# EAGLE design MainBoard (EAGLE 9.3.0)
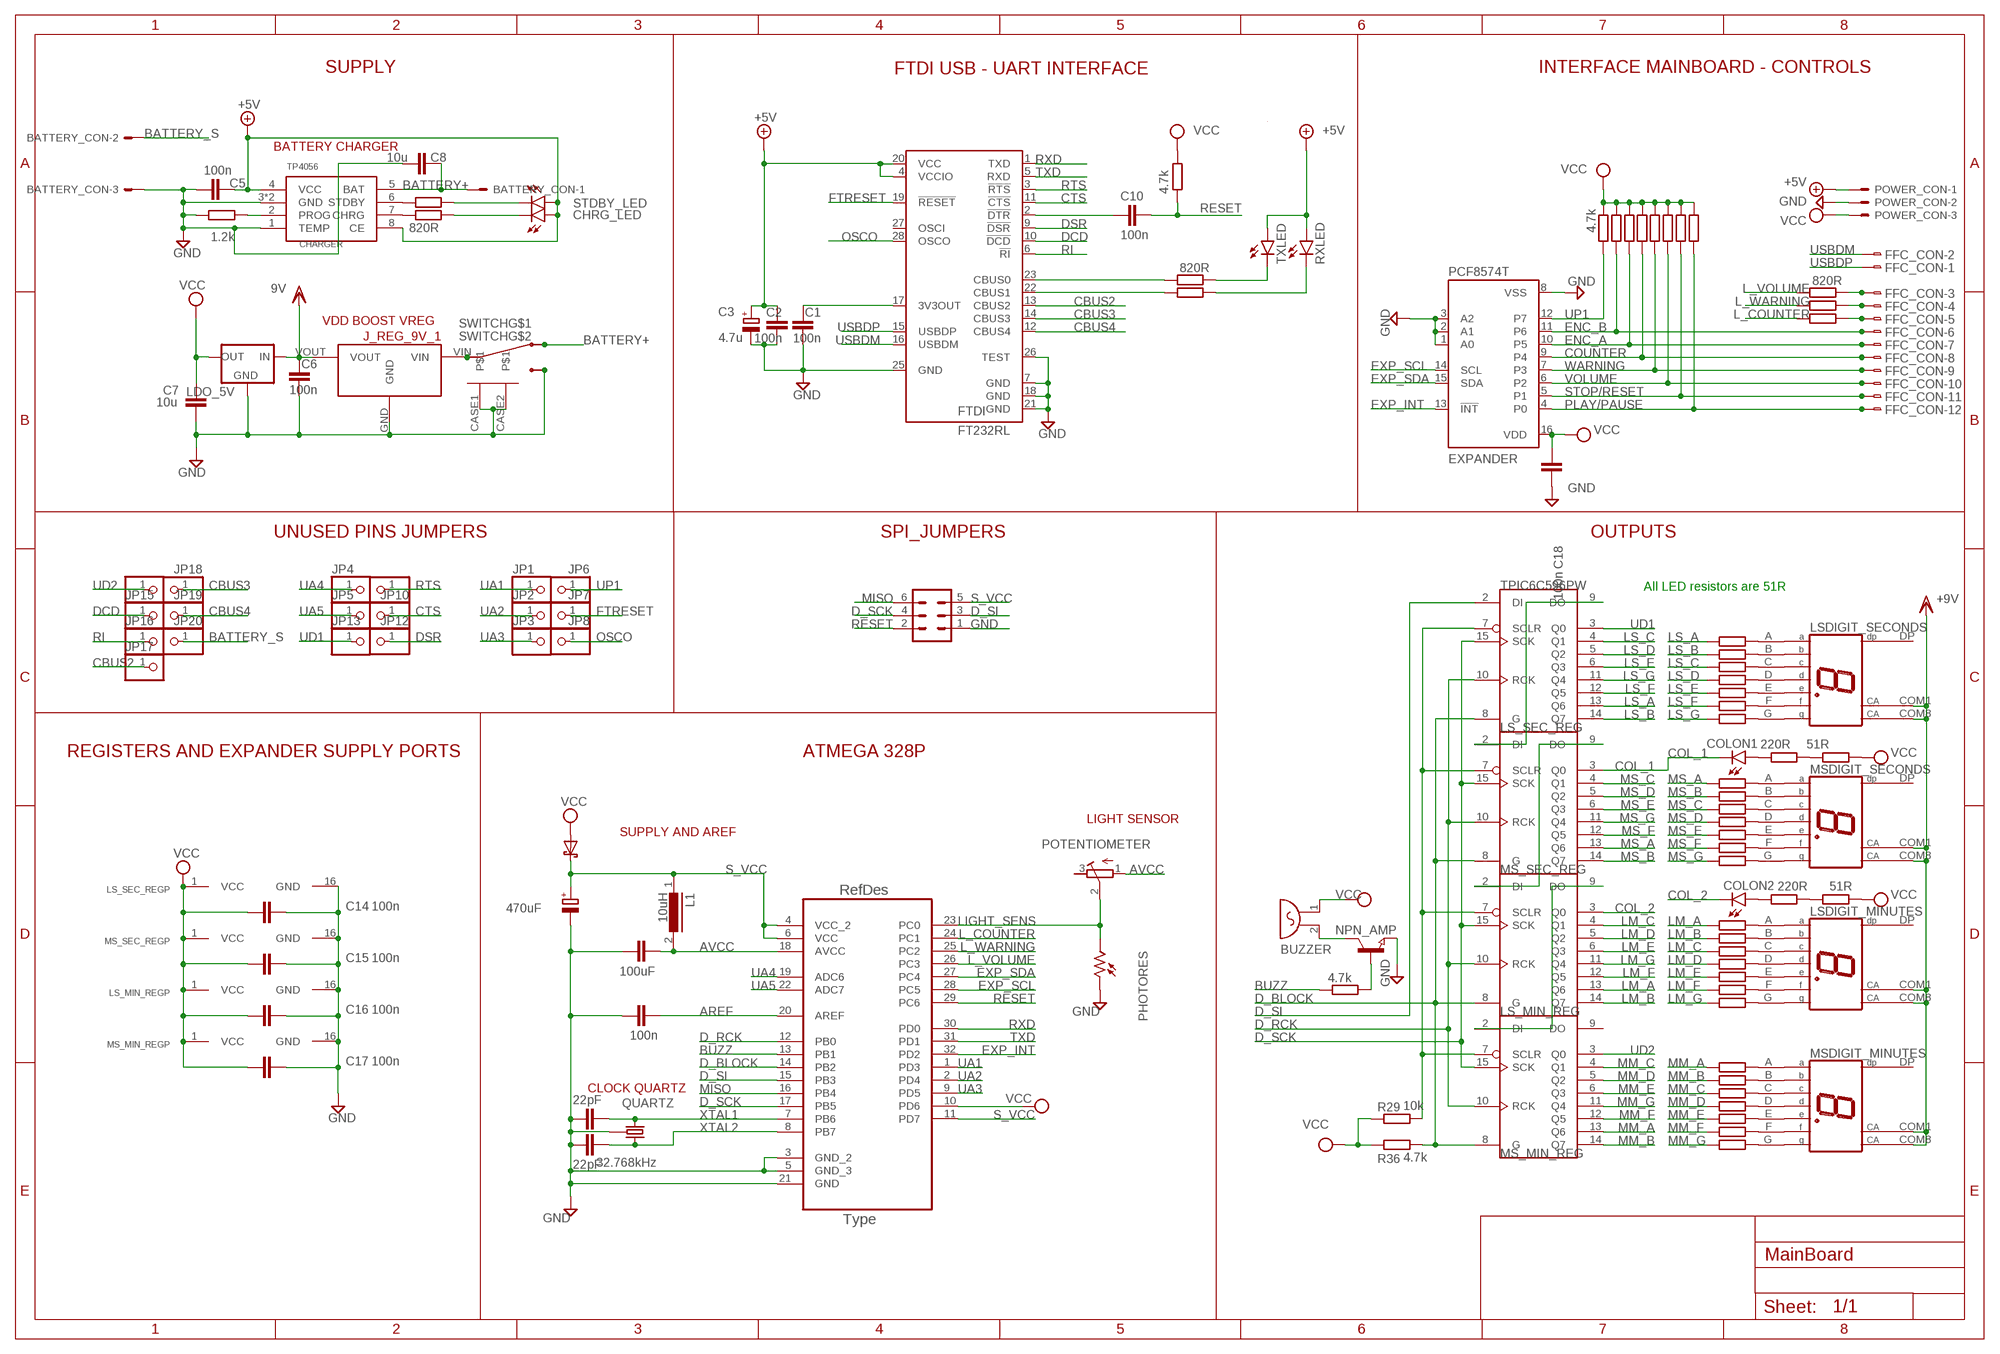
[diagram p0: schematic, sheet 1]

## Parts
ATMEGA328P  ATMEGA328P-AU  [QFP80P900X900X120-32N]
BATTERY_CON  JST-XH-03-PIN-LONG-PAD  [JST-XH-03-PACKAGE-LONG-PAD]
BUZZER  F/HGP  [F/HGP]
C1  100n  C-EUC0603  [C0603]
C2  100n  C-EUC0603  [C0603]
C3  4.7u  CPOL-EUSMCB  [SMC_B]
C4  100n  C-EUC0603  [C0603]
C5  100n  C-EUC0603  [C0603]
C6  100n  C-EUC0603  [C0603]
C7  10u  C-EUC1206  [C1206]
C8  10u  C-EUC1206  [C1206]
C10  100n  C-EUC0603  [C0603]
C14  100n  C-EUC0603  [C0603]
C15  100n  C-EUC0603  [C0603]
C16  100n  C-EUC0603  [C0603]
C17  100n  C-EUC0603  [C0603]
C18  100n  C-EUC0603  [C0603]
C29  22pF  C-EUC0603  [C0603]
C30  22pF  C-EUC0603  [C0603]
C31  470uF  CPOL-EU153CLV-0810  [153CLV-0810]
C32  100uF  C-EUC1210  [C1210]
CHARGER  TP4056  [SOP-8]
CHRG_LED  LEDCHIPLED_0603  [CHIPLED_0603]
COLON1  LED5MM  [LED5MM]
COLON2  LED5MM  [LED5MM]
EXPANDER  PCF8574T  [SO16W]
FFC_CON  FH12-12S-0.5S_THINNER  [FH12-12S-0.5SH_THINER]
FTDI  FT232RL  [SSOP28]
J_REG_9V_1  9V_VOLTAGE_REGULATOR  [9V_VOLTAGE_REGULATOR]
JP1  PINHD-1X1  [1X01]
JP2  PINHD-1X1  [1X01]
JP3  PINHD-1X1  [1X01]
JP4  PINHD-1X1  [1X01]
JP5  PINHD-1X1  [1X01]
JP6  PINHD-1X1  [1X01]
JP7  PINHD-1X1  [1X01]
JP8  PINHD-1X1  [1X01]
JP9  PINHD-1X1  [1X01]
JP10  PINHD-1X1  [1X01]
JP12  PINHD-1X1  [1X01]
JP13  PINHD-1X1  [1X01]
JP14  PINHD-1X1  [1X01]
JP15  PINHD-1X1  [1X01]
JP16  PINHD-1X1  [1X01]
JP17  PINHD-1X1  [1X01]
JP18  PINHD-1X1  [1X01]
JP19  PINHD-1X1  [1X01]
JP20  PINHD-1X1  [1X01]
L1  10uH  DR73  [DR73]
LDO_5V  LM1117  [SOT223]
LS_MIN_REG  TPIC6C596PW  [SO16]
LS_SEC_REG  TPIC6C596PW  [SO16]
LSDIGIT_MINUTES  LED-7-SEGM-56MM  [MYTHT]
LSDIGIT_SECONDS  LED-7-SEGM-56MM  [MYTHT]
MS_MIN_REG  TPIC6C596PW  [SO16]
MS_SEC_REG  TPIC6C596PW  [SO16]
MSDIGIT_MINUTES  LED-7-SEGM-56MM  [MYTHT]
MSDIGIT_SECONDS  LED-7-SEGM-56MM  [MYTHT]
NPN_AMP  NPN-TRANSISTOR_SOT23  [SOT23]
PHOTORES  VT90N1  [VT900]
POTENTIOMETER  R-TRIMM3296Y  [RTRIM3296Y]
POWER_CON  JST-XH-03-PIN-LONG-PAD  [JST-XH-03-PACKAGE-LONG-PAD]
QUARTZ  32.768kHz  CRYSTAL-32.768KHZ_GNDSMD-2X6  [CRYSTAL-SMD-2X6-CYL]
R1  50  R-EU_R0603  [R0603]
R2  50  R-EU_R0603  [R0603]
R3  50  R-EU_R0603  [R0603]
R4  50  R-EU_R0603  [R0603]
R5  50  R-EU_R0603  [R0603]
R6  50  R-EU_R0603  [R0603]
R7  50  R-EU_R0603  [R0603]
R8  50  R-EU_R0603  [R0603]
R9  50  R-EU_R0603  [R0603]
R10  50  R-EU_R0603  [R0603]
R11  50  R-EU_R0603  [R0603]
R12  50  R-EU_R0603  [R0603]
R13  50  R-EU_R0603  [R0603]
R14  50  R-EU_R0603  [R0603]
R15  50  R-EU_R0603  [R0603]
R16  50  R-EU_R0603  [R0603]
R17  50  R-EU_R0603  [R0603]
R18  50  R-EU_R0603  [R0603]
R19  50  R-EU_R0603  [R0603]
R20  50  R-EU_R0603  [R0603]
R21  50  R-EU_R0603  [R0603]
R22  50  R-EU_R0603  [R0603]
R23  50  R-EU_R0603  [R0603]
R24  50  R-EU_R0603  [R0603]
R25  50  R-EU_R0603  [R0603]
R26  50  R-EU_R0603  [R0603]
R27  50  R-EU_R0603  [R0603]
R28  50  R-EU_R0603  [R0603]
R29  10k  R-EU_R0603  [R0603]
R30  4.7k  R-EU_R0603  [R0603]
R31  4.7k  R-EU_R0603  [R0603]
R32  51R  R-EU_R0603  [R0603]
R33  4.7k  R-EU_R0603  [R0603]
R34  220R  R-EU_R0603  [R0603]
R35  51R  R-EU_R0603  [R0603]
R36  4.7k  R-EU_R0603  [R0603]
R39  820R  R-EU_R0603  [R0603]
R40  820R  R-EU_R0603  [R0603]
R42  4.7k  R-EU_R0603  [R0603]
R43  4.7k  R-EU_R0603  [R0603]
R44  4.7k  R-EU_R0603  [R0603]
R45  4.7k  R-EU_R0603  [R0603]
R46  4.7k  R-EU_R0603  [R0603]
R47  820R  R-EU_R0603  [R0603]
R48  1.2k  R-EU_R0603  [R0603]
R50  220R  R-EU_R0603  [R0603]
R52  820R  R-EU_R0603  [R0603]
R56  4.7k  R-EU_R0603  [R0603]
R61  4.7k  R-EU_R0603  [R0603]
R64  820R  R-EU_R0603  [R0603]
R65  820R  R-EU_R0603  [R0603]
R66  820R  R-EU_R0603  [R0603]
RXLED  LEDCHIPLED_0603  [CHIPLED_0603]
SHOTTKY  S2A  [DO214AA]
SPI_JUMPERS  MA03-2  [MA03-2]
STDBY_LED  LEDCHIPLED_0603  [CHIPLED_0603]
SWITCH  X2  [MINI]
TXLED  LEDCHIPLED_0603  [CHIPLED_0603]

## Nets
+5V: C2.2 C3.+ C5.1 CHARGER.4(VCC) CHARGER.8(CE) CHRG_LED.A FTDI.4(VCCIO) FTDI.20(VCC) POWER_CON.1 RXLED.A STDBY_LED.A TXLED.A
AREF: ATMEGA328P.20(AREF) C4.1
AVCC: ATMEGA328P.18(AVCC) C32.1 L1.2 POTENTIOMETER.1(A)
BATTERY+: BATTERY_CON.1 C8.2 CHARGER.5(BAT) SWITCH.1 SWITCH.4
BATTERY_S: BATTERY_CON.2 JP20.1
BUZZ: ATMEGA328P.13(PB1) R30.2
CBUS2: FTDI.13(CBUS2) JP17.1
CBUS3: FTDI.14(CBUS3) JP18.1
CBUS4: FTDI.12(CBUS4) JP19.1
COL_1: COLON1.K(C) MS_SEC_REG.3(Q0)
COL_2: COLON2.K(C) LS_MIN_REG.3(Q0)
COUNTER: EXPANDER.9(P4) FFC_CON.8 R42.2
CTS: FTDI.11(!CTS) JP10.1
D_BLOCK: ATMEGA328P.14(PB2) LS_MIN_REG.8(G) LS_SEC_REG.8(G) MS_MIN_REG.8(G) MS_SEC_REG.8(G) R36.1
D_RCK: ATMEGA328P.12(PB0) LS_MIN_REG.10(RCK) LS_SEC_REG.10(RCK) MS_MIN_REG.10(RCK) MS_SEC_REG.10(RCK)
D_SCK: ATMEGA328P.17(PB5) LS_MIN_REG.15(SCK) LS_SEC_REG.15(SCK) MS_MIN_REG.15(SCK) MS_SEC_REG.15(SCK) SPI_JUMPERS.4
D_SI: ATMEGA328P.15(PB3) LS_SEC_REG.2(DI) SPI_JUMPERS.3
DCD: FTDI.10(!DCD) JP15.1
DSR: FTDI.9(!DSR) JP12.1
DTR: C10.2 FTDI.2(!DTR)
ENC_A: EXPANDER.10(P5) FFC_CON.7 R33.2
ENC_B: EXPANDER.11(P6) FFC_CON.6 R31.2
EXP_INT: ATMEGA328P.32(PD2) EXPANDER.13(!INT)
EXP_SCL: ATMEGA328P.28(PC5) EXPANDER.14(SCL)
EXP_SDA: ATMEGA328P.27(PC4) EXPANDER.15(SDA)
FTRESET: FTDI.19(!RESET) JP7.1
GND: ATMEGA328P.3(GND_2) ATMEGA328P.5(GND_3) ATMEGA328P.21(GND) BATTERY_CON.3 C1.1 C2.1 C3.- C4.2 C5.2 C6.1 C7.2 C8.1 C14.1 C15.1 C16.1 C17.1 C18.1 C29.1 C30.1 C31.- C32.2 CHARGER.1(TEMP) CHARGER.3(GND) CHARGER.ETP(GND) EXPANDER.1(A0) EXPANDER.2(A1) EXPANDER.3(A2) EXPANDER.8(VSS) FTDI.7(GND) FTDI.18(GND) FTDI.21(GND) FTDI.25(GND) FTDI.26(TEST) J_REG_9V_1.GND LDO_5V.1(GND) LS_MIN_REG.16(GND) LS_SEC_REG.16(GND) MS_MIN_REG.16(GND) MS_SEC_REG.16(GND) NPN_AMP.2(E) PHOTORES.1 POWER_CON.2 QUARTZ.SHEILD(GND) R48.2 SPI_JUMPERS.1 SWITCH.3 SWITCH.6 SWITCH.CASE1 SWITCH.CASE2
L_COUNTER: ATMEGA328P.24(PC1) R52.2
L_VOLUME: ATMEGA328P.26(PC3) R64.2
L_WARNING: ATMEGA328P.25(PC2) R47.2
LIGHT_SENS: ATMEGA328P.23(PC0) PHOTORES.2 POTENTIOMETER.2(S)
LM_A: LS_MIN_REG.13(Q6) R7.2
LM_B: LS_MIN_REG.14(Q7) R6.2
LM_C: LS_MIN_REG.4(Q1) R5.2
LM_D: LS_MIN_REG.5(Q2) R4.2
LM_E: LS_MIN_REG.6(Q3) R3.2
LM_F: LS_MIN_REG.12(Q5) R2.2
LM_G: LS_MIN_REG.11(Q4) R1.2
LS_A: LS_SEC_REG.13(Q6) R21.2
LS_B: LS_SEC_REG.14(Q7) R20.2
LS_C: LS_SEC_REG.4(Q1) R19.2
LS_D: LS_SEC_REG.5(Q2) R18.2
LS_E: LS_SEC_REG.6(Q3) R17.2
LS_F: LS_SEC_REG.12(Q5) R16.2
LS_G: LS_SEC_REG.11(Q4) R15.2
MISO: ATMEGA328P.16(PB4) SPI_JUMPERS.6
MM_A: MS_MIN_REG.13(Q6) R27.2
MM_B: MS_MIN_REG.14(Q7) R26.2
MM_C: MS_MIN_REG.4(Q1) R25.2
MM_D: MS_MIN_REG.5(Q2) R24.2
MM_E: MS_MIN_REG.6(Q3) R23.2
MM_F: MS_MIN_REG.12(Q5) R22.2
MM_G: MS_MIN_REG.11(Q4) R28.2
MS_A: MS_SEC_REG.13(Q6) R14.2
MS_B: MS_SEC_REG.14(Q7) R13.2
MS_C: MS_SEC_REG.4(Q1) R12.2
MS_D: MS_SEC_REG.5(Q2) R11.2
MS_E: MS_SEC_REG.6(Q3) R10.2
MS_F: MS_SEC_REG.12(Q5) R9.2
MS_G: MS_SEC_REG.11(Q4) R8.2
N$1: R32.2 R50.1
N$3: MSDIGIT_MINUTES.F R22.1
N$13: LSDIGIT_MINUTES.G R1.1
N$14: MSDIGIT_MINUTES.E R23.1
N$15: LSDIGIT_MINUTES.F R2.1
N$16: LSDIGIT_MINUTES.E R3.1
N$17: LSDIGIT_MINUTES.D R4.1
N$18: LSDIGIT_MINUTES.C R5.1
N$19: LSDIGIT_MINUTES.B R6.1
N$20: FFC_CON.3 R64.1
N$21: MSDIGIT_MINUTES.D R24.1
N$22: FFC_CON.4 R47.1
N$23: MSDIGIT_MINUTES.C R25.1
N$24: LS_MIN_REG.7(SCLR) LS_SEC_REG.7(SCLR) MS_MIN_REG.7(SCLR) MS_SEC_REG.7(SCLR) R29.1
N$25: LSDIGIT_MINUTES.A R7.1
N$27: C1.2 FTDI.17(3V3OUT)
N$29: COLON2.A R34.2
N$30: FFC_CON.5 R52.1
N$31: MSDIGIT_MINUTES.B R26.1
N$32: MSDIGIT_MINUTES.A R27.1
N$33: MSDIGIT_SECONDS.G R8.1
N$34: MSDIGIT_SECONDS.F R9.1
N$35: MSDIGIT_SECONDS.E R10.1
N$36: FTDI.23(CBUS0) R66.2
N$37: MSDIGIT_SECONDS.D R11.1
N$38: MSDIGIT_SECONDS.C R12.1
N$39: MSDIGIT_SECONDS.B R13.1
N$40: MSDIGIT_SECONDS.A R14.1
N$41: LSDIGIT_SECONDS.G R15.1
N$42: LSDIGIT_SECONDS.F R16.1
N$43: FTDI.22(CBUS1) R65.2
N$44: LSDIGIT_SECONDS.E R17.1
N$45: LSDIGIT_SECONDS.D R18.1
N$46: LSDIGIT_SECONDS.C R19.1
N$47: LSDIGIT_SECONDS.B R20.1
N$48: LSDIGIT_SECONDS.A R21.1
N$49: R34.1 R35.2
N$52: CHARGER.7(CHRG) R39.2
N$53: CHARGER.6(STDBY) R40.2
N$54: CHRG_LED.C R39.1
N$55: R40.1 STDBY_LED.C
N$56: COLON1.A R50.2
N$57: MSDIGIT_MINUTES.G R28.1
N$64: R66.1 TXLED.C
N$65: NPN_AMP.1(B) R30.1
N$66: BUZZER.2 NPN_AMP.3(C)
N$74: R65.1 RXLED.C
N$78: LS_MIN_REG.2(DI) MS_SEC_REG.9(DO)
N$79: LS_MIN_REG.9(DO) MS_MIN_REG.2(DI)
N$80: LS_SEC_REG.9(DO) MS_SEC_REG.2(DI)
N$81: J_REG_9V_1.VIN SWITCH.2 SWITCH.5
N$82: CHARGER.2(PROG) R48.1
OSCO: FTDI.28(OSCO) JP8.1
PLAY/PAUSE: EXPANDER.4(P0) FFC_CON.12 R46.2
RESET: ATMEGA328P.29(PC6) C10.1 R56.1 SPI_JUMPERS.2
RI: FTDI.6(!RI) JP16.1
RTS: FTDI.3(!RTS) JP9.1
RXD: ATMEGA328P.30(PD0) FTDI.1(TXD)
S_VCC: ATMEGA328P.4(VCC_2) ATMEGA328P.6(VCC) ATMEGA328P.11(PD7) C31.+ L1.1 SHOTTKY.C SPI_JUMPERS.5
STOP/RESET: EXPANDER.5(P1) FFC_CON.11 R45.2
TXD: ATMEGA328P.31(PD1) FTDI.5(RXD)
UA1: ATMEGA328P.1(PD3) JP1.1
UA2: ATMEGA328P.2(PD4) JP2.1
UA3: ATMEGA328P.9(PD5) JP3.1
UA4: ATMEGA328P.19(ADC6) JP4.1
UA5: ATMEGA328P.22(ADC7) JP5.1
UD1: JP13.1 LS_SEC_REG.3(Q0)
UD2: JP14.1 MS_MIN_REG.3(Q0)
UP1: EXPANDER.12(P7) JP6.1 R61.2
USBDM: FFC_CON.2 FTDI.16(USBDM)
USBDP: FFC_CON.1 FTDI.15(USBDP)
VCC: ATMEGA328P.10(PD6) BUZZER.1 C7.1 C14.2 C15.2 C16.2 C17.2 C18.2 EXPANDER.16(VDD) LDO_5V.2(OUT) LDO_5V.4(OUT) LS_MIN_REG.1(VCC) LS_SEC_REG.1(VCC) MS_MIN_REG.1(VCC) MS_SEC_REG.1(VCC) POWER_CON.3 R29.2 R31.1 R32.1 R33.1 R35.1 R36.2 R42.1 R43.1 R44.1 R45.1 R46.1 R56.2 R61.1 SHOTTKY.A
VDD: C6.2 J_REG_9V_1.VOUT LDO_5V.3(IN) LSDIGIT_MINUTES.COM1(CA1) LSDIGIT_MINUTES.COM8(CA8) LSDIGIT_SECONDS.COM1(CA1) LSDIGIT_SECONDS.COM8(CA8) MSDIGIT_MINUTES.COM1(CA1) MSDIGIT_MINUTES.COM8(CA8) MSDIGIT_SECONDS.COM1(CA1) MSDIGIT_SECONDS.COM8(CA8) ; supply symbol labelled +9V, 9V
VOLUME: EXPANDER.6(P2) FFC_CON.10 R44.2
WARNING: EXPANDER.7(P3) FFC_CON.9 R43.2
XTAL1: ATMEGA328P.7(PB6) C29.2 QUARTZ.X2
XTAL2: ATMEGA328P.8(PB7) C30.2 QUARTZ.X1
Unconnected: FFC_CON.CASE1 FFC_CON.CASE2 FTDI.27(OSCI) LSDIGIT_MINUTES.DP LSDIGIT_SECONDS.DP MS_MIN_REG.9(DO) MSDIGIT_MINUTES.DP MSDIGIT_SECONDS.DP POTENTIOMETER.3(E)

## Notes on the sheet
- SUPPLY | FTDI USB - UART INTERFACE | INTERFACE MAINBOARD - CONTROLS
- BATTERY CHARGER
- VDD BOOST VREG
- UNUSED PINS JUMPERS | OUTPUTS
- All LED resistors are 51R
- REGISTERS AND EXPANDER SUPPLY PORTS | ATMEGA 328P
- LIGHT SENSOR
- SUPPLY AND AREF
- CLOCK QUARTZ

## Library data of the parts
ATMEGA328P = atmega328:ATMEGA328P-AU; DESCRIPTION: 8-bit Microcontroller with In-System Programmable Flash; MPN: ATMEGA328P-AU; OC_FARNELL: 1715486; OC_NEWARK: 14R4631; PACKAGE: TQFP-32; SUPPLIER: Atmel
BATTERY_CON POWER_CON = Rembrandt Electronics - JST XH Connectors v1-0:JST-XH-03-PIN: JST XH Connector 2 Pin Wire to board connector. Pitch: 2,54 mm, (0.100") Number of pins: 3 Created by Rembrandt Electronics www.rembrandtelectronics.com
BUZZER = Mybuzzer:F/HGP: BUZZER Source: Buerklin; OC_FARNELL: unknown; OC_NEWARK: unknown
C1 C2 C4-C8 C10 C14-C18 C29 C30 C32 = rcl:C-EU: CAPACITOR, European symbol; SPICEPREFIX: C
C3 C31 = rcl:CPOL-EU: POLARIZED CAPACITOR, European symbol; SPICEPREFIX: C
CHARGER = TP4056:TP4056
CHRG_LED RXLED STDBY_LED TXLED = led:LED: LED OSRAM: - CHIPLED LG R971, LG N971, LY N971, LG Q971, LY Q971, LO R971, LY R971 LH N974, LH R974 LS Q976, LO Q976, LY Q976 LO Q996 - Hyper CHIPLED LW Q18S LB Q993, LB Q99A, LB R99A - SideLED LS A670, LO A670, LY A670, LG A670, LP A670 LB A673, LV A673, LT A673, LW A673 LH A674 LY A675 LS A676, LA A676, LO A676, LY A676, LW A676 LS A679, LY A679, LG A679 - Hyper Micro SIDELED® LS Y876, LA Y876, LO Y876, LY Y876 LT Y87S - SmartLED LW L88C, LW L88S LB L89C, LB L89S, LG L890 LS L89K, LO L89K, LY L89K LS L896, LA L896, LO L896, LY L896 - TOPLED LS T670, LO T670, LY T670, LG T670, LP T670 LSG T670, LSP T670, LSY T670, LOP T670, LYG T670 LG T671, LOG T671, LSG T671 LB T673, LV T673, LT T673, LW T673 LH T674 LS T676, LA T676, LO T676, LY T676, LB T676, LH T676, LSB T676, LW T676 LB T67C, LV T67C, LT T67C, LS T67K, LO T67K, LY T67K, LW E67C LS E67B, LA E67B, LO E67B, LY E67B, LB E67C, LV E67C, LT E67C LW T67C LS T679, LY T679, LG T679 LS T770, LO T770, LY T770, LG T770, LP T770 LB T773, LV T773, LT T773, LW T773 LH T774 LS E675, LA E675, LY E675, LS T675 LS T776, LA T776, LO T776, LY T776, LB T776 LHGB T686 LT T68C, LB T68C - Hyper Mini TOPLED® LB M676 - Mini TOPLED Santana® LG M470 LS M47K, LO M47K, LY M47K Source: http://www.osram.convergy.de LUXEON: - LUMILED® LXK2-PW12-R00, LXK2-PW12-S00, LXK2-PW14-U00, LXK2-PW14-V00 LXK2-PM12-R00, LXK2-PM12-S00, LXK2-PM14-U00 LXK2-PE12-Q00, LXK2-PE12-R00, LXK2-PE12-S00, LXK2-PE14-T00, LXK2-PE14-U00 LXK2-PB12-K00, LXK2-PB12-L00, LXK2-PB12-M00, LXK2-PB14-N00, LXK2-PB14-P00, LXK2-PB14-Q00 LXK2-PR12-L00, LXK2-PR12-M00, LXK2-PR14-Q00, LXK2-PR14-R00 LXK2-PD12-Q00, LXK2-PD12-R00, LXK2-PD12-S00 LXK2-PH12-R00, LXK2-PH12-S00 LXK2-PL12-P00, LXK2-PL12-Q00, LXK2-PL12-R00 Source: www.luxeon.com KINGBRIGHT: KA-3528ASYC Source: www.kingbright.com
COLON1 COLON2 = Myled:LED: LED OSRAM: - CHIPLED LG R971, LG N971, LY N971, LG Q971, LY Q971, LO R971, LY R971 LH N974, LH R974 LS Q976, LO Q976, LY Q976 LO Q996 - Hyper CHIPLED LW Q18S LB Q993, LB Q99A, LB R99A - SideLED LS A670, LO A670, LY A670, LG A670, LP A670 LB A673, LV A673, LT A673, LW A673 LH A674 LY A675 LS A676, LA A676, LO A676, LY A676, LW A676 LS A679, LY A679, LG A679 - Hyper Micro SIDELED® LS Y876, LA Y876, LO Y876, LY Y876 LT Y87S - SmartLED LW L88C, LW L88S LB L89C, LB L89S, LG L890 LS L89K, LO L89K, LY L89K LS L896, LA L896, LO L896, LY L896 - TOPLED LS T670, LO T670, LY T670, LG T670, LP T670 LSG T670, LSP T670, LSY T670, LOP T670, LYG T670 LG T671, LOG T671, LSG T671 LB T673, LV T673, LT T673, LW T673 LH T674 LS T676, LA T676, LO T676, LY T676, LB T676, LH T676, LSB T676, LW T676 LB T67C, LV T67C, LT T67C, LS T67K, LO T67K, LY T67K, LW E67C LS E67B, LA E67B, LO E67B, LY E67B, LB E67C, LV E67C, LT E67C LW T67C LS T679, LY T679, LG T679 LS T770, LO T770, LY T770, LG T770, LP T770 LB T773, LV T773, LT T773, LW T773 LH T774 LS E675, LA E675, LY E675, LS T675 LS T776, LA T776, LO T776, LY T776, LB T776 LHGB T686 LT T68C, LB T68C - Hyper Mini TOPLED® LB M676 - Mini TOPLED Santana® LG M470 LS M47K, LO M47K, LY M47K Source: http://www.osram.convergy.de LUXEON: - LUMILED® LXK2-PW12-R00, LXK2-PW12-S00, LXK2-PW14-U00, LXK2-PW14-V00 LXK2-PM12-R00, LXK2-PM12-S00, LXK2-PM14-U00 LXK2-PE12-Q00, LXK2-PE12-R00, LXK2-PE12-S00, LXK2-PE14-T00, LXK2-PE14-U00 LXK2-PB12-K00, LXK2-PB12-L00, LXK2-PB12-M00, LXK2-PB14-N00, LXK2-PB14-P00, LXK2-PB14-Q00 LXK2-PR12-L00, LXK2-PR12-M00, LXK2-PR14-Q00, LXK2-PR14-R00 LXK2-PD12-Q00, LXK2-PD12-R00, LXK2-PD12-S00 LXK2-PH12-R00, LXK2-PH12-S00 LXK2-PL12-P00, LXK2-PL12-Q00, LXK2-PL12-R00 Source: www.luxeon.com KINGBRIGHT: KA-3528ASYC Source: www.kingbright.com
EXPANDER = micro-philips:PCF8574: I2C-Bus Remote 8-bit I/O expander http://www.semiconductors.philips.com/acrobat_download/datasheets/PCF8574_4.pdf; MPN: PCF8574T/3,512; OC_FARNELL: 1201255; OC_NEWARK: 70R6870
FFC_CON = My_con-hirose:FH12-12S-0.5S_THINNER: 0.5mm Pitch Connectors For FPC/FFC Source: Data sheet <http://www.hirose.co.jp/cataloge_hp/e58605370.pdf>
FTDI = ftdi:FT232R: Source: http://www.ftdichip.com/Documents/DataSheets/DS_FT232R_v104.pdf; MPN: FT232RL; OC_FARNELL: 1146032; OC_NEWARK: 91K9918
J_REG_9V_1 = Pololu_vreg:9V_VOLTAGE_REGULATOR: Polulu 9V Step-Up Voltage Regulator U3V12F9
JP1-JP10 JP12-JP20 = pinhead:PINHD-1X1: PIN HEADER
L1 = inductors:DR73: High Power Density, High Efficiency, Shielded Inductors Source: coiltronics_dr_series.pdf; SPICEPREFIX: L
LDO_5V = v-reg-2:LM1117
LS_MIN_REG LS_SEC_REG MS_MIN_REG MS_SEC_REG = tpic:TPIC6C596
LSDIGIT_MINUTES LSDIGIT_SECONDS MSDIGIT_MINUTES MSDIGIT_SECONDS = BigLED7Segm:LED-7-SEGM-56MM
NPN_AMP = semicon-smd-ipc:NPN-TRANSISTOR_: NPN TRANSISTOR
PHOTORES = Myphoto-elements:VT9: Photoconductive Cell VT900 Series Source: http://optoelectronics.perkinelmer.com/content/Datasheets/DTS_vt900seriesdatasheet.pdf; SPICEPREFIX: B
POTENTIOMETER = Myrcl:R-TRIMM: Trimm resistor; SPICEMODEL: X; SPICEPREFIXL: POT
QUARTZ = crystal_clock:CRYSTAL-32.768KHZ_GND: 32.768kHz Crystal Frequency: 32.768kHz Frequency Stability: ±20ppm Load Capacitance: 12.5pF (PTH-2X6 & SMD-3.2X1.5), 6pF (SMD-2X6) SparkFun Products: SparkFun BigTime Watch Kit <https://www.sparkfun.com/products/11734> SparkFun nRF52832 Breakout <https://www.sparkfun.com/products/13990> SparkFun Real Time Clock Module <https://www.sparkfun.com/products/12708>; PROD_ID: XTAL-07894
R1-R36 R39 R40 R42-R48 R50 R52 R56 R61 R64-R66 = rcl:R-EU_: RESISTOR, European symbol; SPICEPREFIX: R
SHOTTKY = Shottky:S2*: S2A - S2M General Purpose Rectifiers Source: http://www.fairchildsemi.com/datasheets/S2/S2A.pdf; MF: Fairchild; MPN: S2A; OC_FARNELL: 1467485; OC_NEWARK: 58K2391
SPI_JUMPERS = Mycon-lstb:MA03-2: PIN HEADER; OC_FARNELL: unknown; OC_NEWARK: unknown
SWITCH = Isostat:X2

## Board
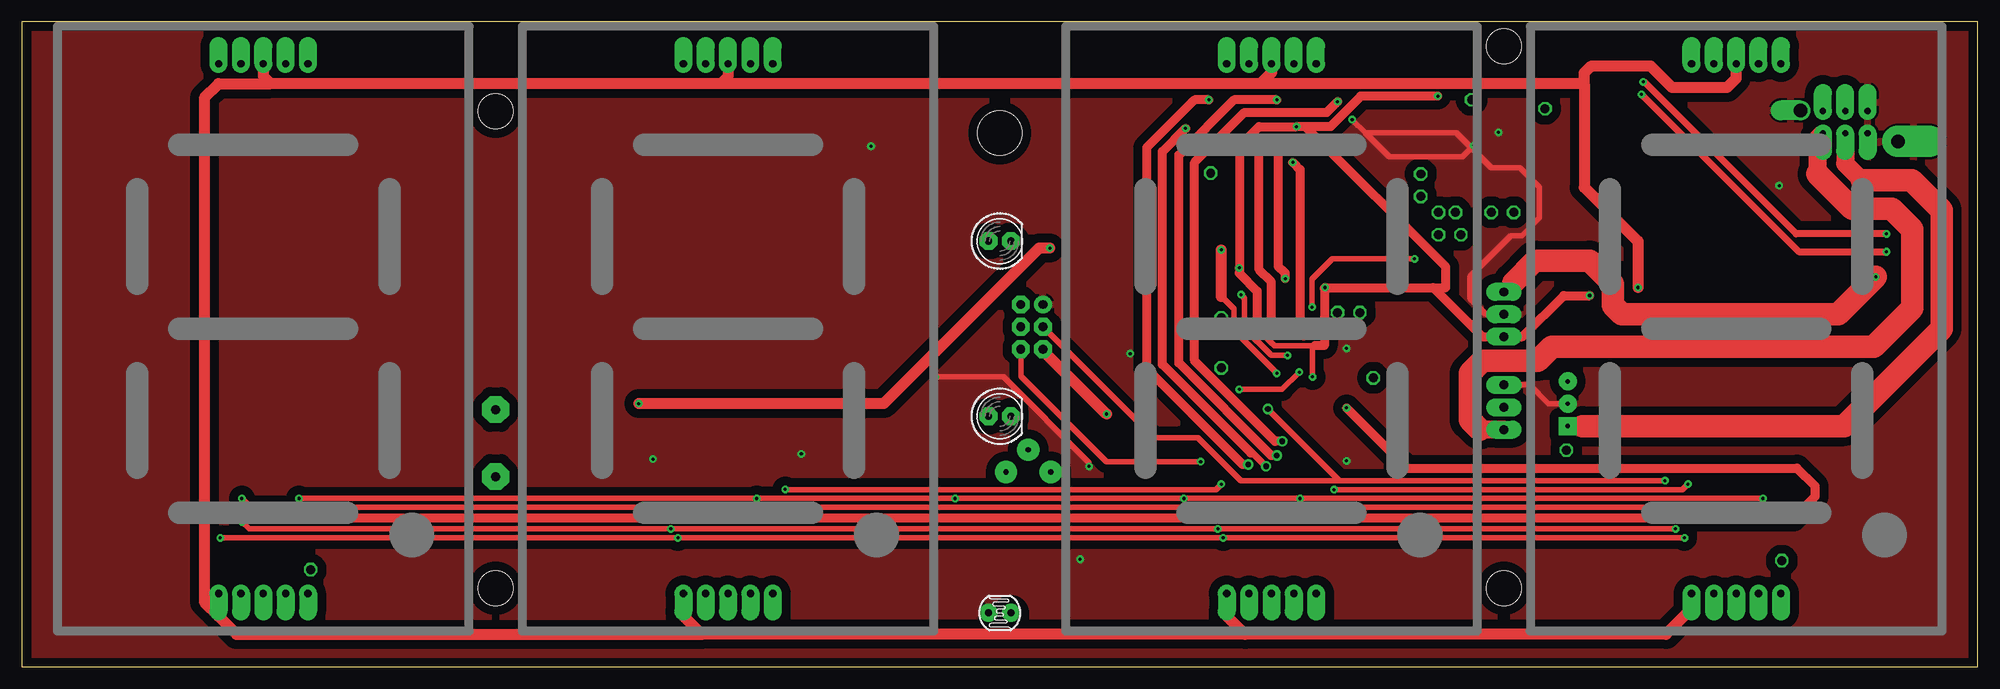
[diagram p1: board, top side]
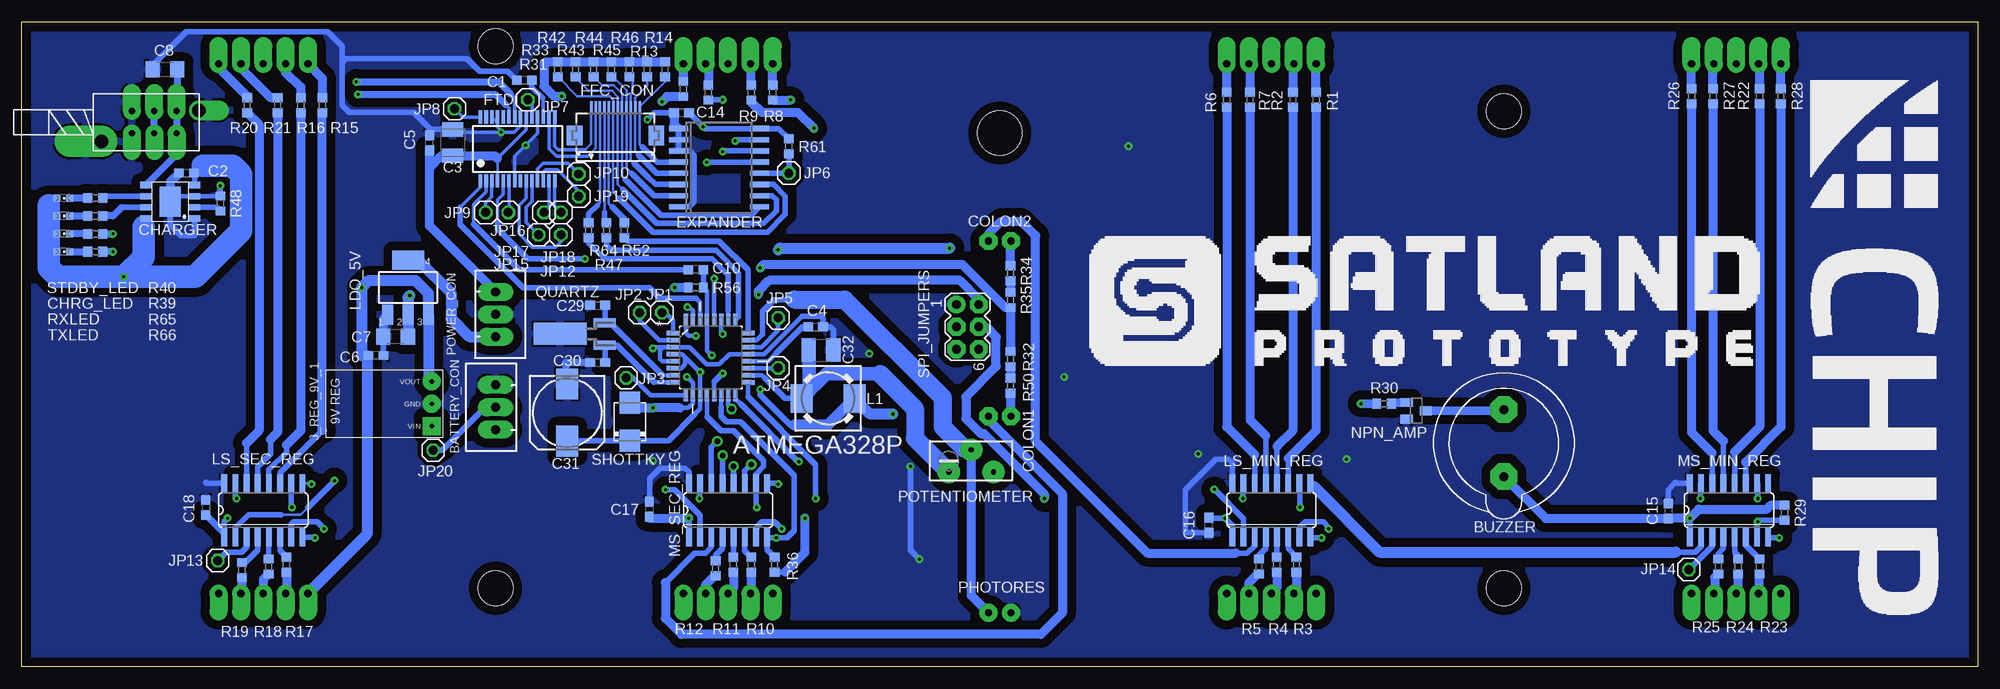
[diagram p2: board, bottom side, seen from below]

Size 222.3 x 73.25 mm. Coordinates in mm from the lower left corner, seen from the top.
Outline: 0,0 222.3,0 222.3,73.25 0,73.25 0,0
Copper layers (1*16): Top 0.035mm / dielectric 1.5mm / Bottom 0.035mm
Design rules "default *": minimum track width 10mil, minimum drill 10mil, track to track 8mil, track to pad 8mil, pad to pad 8mil, via to via 10mil, smd to smd 10mil, copper to edge 10mil, drill to drill 10mil, minimum pad ring 10mil, minimum via ring 10mil, stop-mask expansion 4mil, vias tented up to drill 34mil, thermal gap 10mil
Holes 4 mm at 168.45,8.89 53.85,8.89 53.85,63.09 168.45,70.51
Holes 5.08 mm at 111.15,60.66

### Footprints (pad centres in the part's own frame; a part is rotated, then mirrored left to right if it is on the bottom)
QFP80P900X900X120-32N = smd 1.473 x 0.508: 1 -4.242,2.794; 2 -4.242,2.007; 3 -4.242,1.194; 4 -4.242,0.406; 5 -4.242,-0.406; 6 -4.242,-1.194; 7 -4.242,-2.007; 8 -4.242,-2.794; 17 4.242,-2.794; 18 4.242,-2.007; 19 4.242,-1.194; 20 4.242,-0.406; 21 4.242,0.406; 22 4.242,1.194; 23 4.242,2.007; 24 4.242,2.794 | smd 0.508 x 1.473: 9 -2.794,-4.242; 10 -2.007,-4.242; 11 -1.194,-4.242; 12 -0.406,-4.242; 13 0.406,-4.242; 14 1.194,-4.242; 15 2.007,-4.242; 16 2.794,-4.242; 25 2.794,4.242; 26 2.007,4.242; 27 1.194,4.242; 28 0.406,4.242; 29 -0.406,4.242; 30 -1.194,4.242; 31 -2.007,4.242; 32 -2.794,4.242
JST-XH-03-PACKAGE-LONG-PAD = drill 1.016 pad 2.032 long: 1 -2.54,0; 2 0,0; 3 2.54,0
F/HGP = drill 1.016 pad 3.048 octagon: 1 -3.81,0; 2 3.81,0
C0603 = smd 1.1 x 1: 1 -0.85,0; 2 0.85,0
SMC_B = smd 1.6 x 2.4: + -1.5,0; - 1.5,0
C1206 = smd 1.6 x 1.8: 1 -1.4,0; 2 1.4,0
153CLV-0810 = smd 3.5 x 2.5: + 3.25,0; - -3.25,0
C1210 = smd 1.6 x 2.7: 1 -1.4,0; 2 1.4,0
SOP-8 = smd 1.3 x 0.7: 1 -2.75,1.905; 2 -2.75,0.635; 3 -2.75,-0.635; 4 -2.75,-1.905; 5 2.75,-1.905; 6 2.75,-0.635; 7 2.75,0.635; 8 2.75,1.905 | smd 2.4 x 3.4: ETP 0,0
CHIPLED_0603 = smd 0.8 x 0.8: A 0,-0.75; C 0,0.75
LED5MM = drill 0.813 pad 2.032 octagon: A -1.27,0; K 1.27,0
SO16W = smd 0.6 x 2.2: 1 -4.445,-4.6; 2 -3.175,-4.6; 3 -1.905,-4.6; 4 -0.635,-4.6; 5 0.635,-4.6; 6 1.905,-4.6; 7 3.175,-4.6; 8 4.445,-4.6; 9 4.445,4.6; 10 3.175,4.6; 11 1.905,4.6; 12 0.635,4.6; 13 -0.635,4.6; 14 -1.905,4.6; 15 -3.175,4.6; 16 -4.445,4.6
FH12-12S-0.5SH_THINER = smd 0.29 x 1.3: 1 -2.75,3.25; 2 -2.25,3.25; 3 -1.75,3.25; 4 -1.25,3.25; 5 -0.75,3.25; 6 -0.25,3.25; 7 0.25,3.25; 8 0.75,3.25; 9 1.25,3.25; 10 1.75,3.25; 11 2.25,3.25; 12 2.75,3.25 | smd 1.8 x 2.2: CASE1 -4.65,0; CASE2 4.65,0
SSOP28 = smd 0.4 x 1.5: 1 -4.225,-3.625; 2 -3.575,-3.625; 3 -2.925,-3.625; 4 -2.275,-3.625; 5 -1.625,-3.625; 6 -0.975,-3.625; 7 -0.325,-3.625; 8 0.325,-3.625; 9 0.975,-3.625; 10 1.625,-3.625; 11 2.275,-3.625; 12 2.925,-3.625; 13 3.575,-3.625; 14 4.225,-3.625; 15 4.225,3.625; 16 3.575,3.625; 17 2.925,3.625; 18 2.275,3.625; 19 1.625,3.625; 20 0.975,3.625; 21 0.325,3.625; 22 -0.325,3.625; 23 -0.975,3.625; 24 -1.625,3.625; 25 -2.275,3.625; 26 -2.925,3.625; 27 -3.575,3.625; 28 -4.225,3.625
9V_VOLTAGE_REGULATOR = drill 0.5 pad 2.032: GND 0,-1.27; VOUT 2.54,-1.27 | drill 0.5 pad 2.032 square: VIN -2.54,-1.27
1X01 = drill 1.016 octagon: 1 0,0
DR73 = smd 2.5 x 3.25: 1 -3,0; 2 3,0
SOT223 = smd 1.219 x 2.235: 1 -2.311,-3.099; 2 0,-3.099; 3 2.311,-3.099 | smd 3.6 x 2.2: 4 0,3.099
SO16 = smd 0.66 x 2.032: 1 -4.445,-3.073; 2 -3.175,-3.073; 3 -1.905,-3.073; 4 -0.635,-3.073; 5 0.635,-3.073; 6 1.905,-3.073; 7 3.175,-3.073; 8 4.445,-3.073; 9 4.445,3.073; 10 3.175,3.073; 11 1.905,3.073; 12 0.635,3.073; 13 -0.635,3.073; 14 -1.905,3.073; 15 -3.175,3.073; 16 -4.445,3.073
MYTHT = drill 0.813 pad 2.032 offset: A 2.54,30.1; B 5.08,30.1; C 2.54,-30.1; COM1 -5.08,-30.1; COM8 0,30.1; D 0,-30.1; DP 5.08,-30.1; E -2.54,-30.1; F -2.54,30.1; G -5.08,30.1
SOT23 = smd 1 x 1.4: 1 -0.95,-1.1; 2 0.95,-1.1; 3 0,1.1
VT900 = drill 0.8 pad 2.032: 1 -1.27,0; 2 1.27,0
RTRIM3296Y = drill 0.61 pad 2.54: 1 1.27,-2.54; 2 -1.27,0; 3 1.27,2.54
CRYSTAL-SMD-2X6-CYL = smd 2.5 x 6: SHEILD 0,5.08 | smd 1 x 2.5: X1 -1.27,0; X2 1.27,0
R0603 = smd 1 x 1.1: 1 -0.85,0; 2 0.85,0
DO214AA = smd 2.5 x 2.3: A 2.15,0; C -2.15,0
MA03-2 = drill 1.016 pad 2.032: 1 -2.54,-1.27 | drill 1.016 pad 2.032 octagon: 2 -2.54,1.27; 3 0,-1.27; 4 0,1.27; 5 2.54,-1.27; 6 2.54,1.27
MINI = drill 0.7 pad 2.032 offset: 1 -2.54,-1.27; 2 0,-1.27; 3 2.54,-1.27; 4 -2.54,1.27; 5 0,1.27; 6 2.54,1.27 | drill 1.5 pad 2.032 offset: CASE1 -5.08,-1.325 | drill 1.5 pad 3.556 offset: CASE2 6,2.2

### Placement (x,y rotation side)
ATMEGA328P  144.02,35.1 0 bottom
BATTERY_CON  168.45,29.46 90 bottom
BUZZER  53.85,25.4 90 bottom
C1  165.2,66.65 0 bottom
C2  203.61,56.08 0 bottom
C3  173.33,59.54 90 bottom
C4  132.08,38.61 0 bottom
C5  175.97,59.54 90 bottom
C6  182.07,35.36 180 bottom
C7  179.83,37.49 180 bottom
C8  206.04,67.87 0 bottom
C10  145.69,45.11 180 bottom
C14  147.32,62.94 0 bottom
C15  35.15,17.68 270 bottom
C16  87.38,16.05 90 bottom
C17  150.98,17.88 270 bottom
C18  201.42,18.08 270 bottom
C29  156.87,41.05 0 bottom
C30  156.87,34.54 0 bottom
C31  160.32,28.85 270 bottom
C32  131.47,35.97 0 bottom
CHARGER  205.44,52.83 180 bottom
CHRG_LED  217.63,51.21 270 bottom
COLON1  111.15,28.45 0 top
COLON2  111.15,48.36 0 top
EXPANDER  143.05,56.69 270 bottom
FFC_CON  154.84,60.35 0 bottom
FTDI  165.96,58.83 0 bottom
J_REG_9V_1  176.99,29.87 90 bottom
JP1  149.56,40.23 0 bottom
JP2  152.1,40.23 0 bottom
JP3  153.62,32.82 0 bottom
JP4  136.35,33.93 0 bottom
JP5  136.35,39.62 0 bottom
JP6  135.13,56.08 0 bottom
JP7  164.8,64.41 0 bottom
JP8  173.13,63.4 0 bottom
JP9  169.57,51.61 0 bottom
JP10  159,55.98 0 bottom
JP12  161.04,49.07 0 bottom
JP13  200.05,12.04 0 bottom
JP14  32.82,11.02 0 bottom
JP15  163.58,49.07 0 bottom
JP16  167.03,51.61 0 bottom
JP17  162.97,51.61 180 bottom
JP18  161.04,51.61 180 bottom
JP19  159,53.44 90 bottom
JP20  175.56,24.59 270 bottom
L1  130.66,30.48 180 bottom
LDO_5V  178.41,43.08 0 bottom
LS_MIN_REG  80.26,17.78 0 bottom
LS_SEC_REG  194.87,17.78 0 bottom
LSDIGIT_MINUTES  80.26,38.4 0 top
LSDIGIT_SECONDS  194.87,38.4 0 top
MS_MIN_REG  28.24,17.78 0 bottom
MS_SEC_REG  142.04,17.78 0 bottom
MSDIGIT_MINUTES  27.43,38.4 0 top
MSDIGIT_SECONDS  142.04,38.4 0 top
NPN_AMP  63.8,29.06 270 bottom
PHOTORES  111.15,6.1 0 top
POTENTIOMETER  114.4,23.37 270 bottom
POWER_CON  168.45,40.03 270 bottom
QUARTZ  156.06,37.8 90 bottom
R1  75.18,64.41 270 bottom
R2  77.83,64.41 270 bottom
R3  77.42,11.58 90 bottom
R4  79.65,11.58 90 bottom
R5  81.69,11.38 90 bottom
R6  85.34,64.41 270 bottom
R7  82.7,64.41 270 bottom
R8  136.96,65.23 270 bottom
R9  139.4,65.23 270 bottom
R10  139.4,11.58 90 bottom
R11  141.43,11.58 90 bottom
R12  143.46,11.18 90 bottom
R13  147.12,65.63 270 bottom
R14  144.27,65.23 270 bottom
R15  188.16,63.8 270 bottom
R16  190.6,63.8 270 bottom
R17  192.23,11.58 90 bottom
R18  194.26,11.38 90 bottom
R19  197.31,10.97 90 bottom
R20  196.7,63.8 270 bottom
R21  193.24,63.8 270 bottom
R22  24.77,64.83 270 bottom
R23  24.79,11.38 90 bottom
R24  27.23,11.38 90 bottom
R25  29.46,11.38 90 bottom
R26  32.51,64.82 270 bottom
R27  30.07,64.82 270 bottom
R28  22.35,64.82 270 bottom
R29  21.95,17.48 90 bottom
R30  67.46,29.87 180 bottom
R31  161.39,67.87 270 bottom
R32  109.93,34.95 270 bottom
R33  159.36,67.87 270 bottom
R34  109.93,44.7 90 bottom
R35  109.93,41.66 90 bottom
R36  136.75,11.58 270 bottom
R39  213.97,51.21 0 bottom
R40  213.97,53.24 0 bottom
R42  157.33,67.87 270 bottom
R43  155.3,67.87 270 bottom
R44  153.26,67.87 270 bottom
R45  151.23,67.87 270 bottom
R46  149.2,67.87 270 bottom
R47  155.85,49.58 270 bottom
R48  199.75,52.63 90 bottom
R50  109.93,31.9 270 bottom
R52  153.82,49.58 270 bottom
R56  145.69,43.08 180 bottom
R61  135.13,59.13 270 bottom
R64  157.89,49.58 270 bottom
R65  213.97,49.17 0 bottom
R66  213.97,47.14 0 bottom
RXLED  217.63,49.17 270 bottom
SHOTTKY  153.21,27.84 90 bottom
SPI_JUMPERS  114.81,38.61 270 bottom
STDBY_LED  217.63,53.24 270 bottom
SWITCH  207.26,61.87 180 bottom
TXLED  217.63,47.14 270 bottom

### Tracks (layer width: path | path; a pad name or v marks a point on that pad's centre or on a via)
+5V  (via drill 0.35)
  Top 1.016: POWER_CON.1 169.52,43.64
  Top 2.54: 169.52,43.64 172.01,46.13 178.21,46.13 180.85,43.48 180.85,41.05 181.86,40.03 206.45,40.03 v210.72,44.3
  Bottom 0.305: 168.24,57.74 FTDI.4
  Bottom 0.394: FTDI.20 164.99,60.99
  Bottom 0.406: 164.99,60.99 168.24,57.74
  Bottom 0.61: CHRG_LED.A RXLED.A TXLED.A 219.25,47.14 | CHARGER.8 208.19,50.28 208.48,49.99 | CHARGER.4 202.69,56.01 C2.2 202.59,56.08 201.78,56.9
  Bottom 0.813: STDBY_LED.A 219.19,52.43 219.25,52.43
  Bottom 1.016: POWER_CON.1 175.97,50.09 175.97,56.69 | 175.97,56.69 C5.1 | 175.97,56.69 174.63,58.04 C3.+ 168.53,58.04 168.24,57.74
  Bottom 2.54: 208.48,49.99 208.48,46.53 v210.72,44.3 | v210.72,44.3 218.24,44.3 219.25,45.31 219.25,47.14 219.25,52.43 | v210.72,44.3 202.59,44.3 197.38,49.51 197.38,55.96 198.32,56.9 201.78,56.9
AREF
  Bottom 0.508: ATMEGA328P.20 137.45,34.7 136.57,35.58
  Bottom 0.61: C4.1 133.54,38.61 136.57,35.58
AVCC
  Bottom 0.508: ATMEGA328P.18 138.15,33.1 137.87,32.82
  Bottom 0.61: 137.87,32.82 135.53,30.48 L1.2 132.84,31.29 | C32.1 132.84,35.94
  Bottom 1.524: 132.84,35.94 132.84,31.29 | L1.2 130.86,33.27 124.75,33.27
  Bottom 2.032: 124.75,33.27 120.8,29.32 120.8,25.96 POTENTIOMETER.1
BATTERY+
  Top 2.032: SWITCH.4 204.11,59.99 204.11,55.98 | BATTERY_CON.1 165.71,26.92
  Top 2.54: 204.11,55.98 208.08,52.02 212.55,52.02 214.88,49.68 214.88,40.74 210.51,36.37 173.94,36.37 172.31,34.75 166.01,34.75 164.59,33.33 164.59,28.04 165.71,26.92
  Bottom 0.61: 207.97,54.96 CHARGER.5
  Bottom 0.813: 207.97,54.96 204.72,58.2 SWITCH.4 SWITCH.1 204.65,63.22 C8.2
BATTERY_S
  Bottom 0.61: JP20.1 174.55,24.59 169.67,29.46 BATTERY_CON.2
BUZZ  (via drill 0.35)
  Top 0.61: 136.35,42.06 137.77,40.64 137.77,38.2 v142.65,33.33
  Top 1.27: v116.84,47.55 115.62,47.55 97.94,29.87 v70.1,29.87 | 136.35,42.06 v136.35,47.35
  Bottom 0.508: ATMEGA328P.13 143.61,32.36
  Bottom 0.61: 143.61,32.36 v142.65,33.33
  Bottom 0.991: R30.2 v70.1,29.87
  Bottom 1.27: v136.35,47.35 136.14,47.55 v116.84,47.55
CBUS2
  Bottom 0.394: JP17.1 162.39,52.19 FTDI.13
CBUS3
  Bottom 0.394: JP18.1 161.74,52.31 FTDI.14
CBUS4
  Bottom 0.394: FTDI.12 163.04,56.21 162.76,56.49 161.44,56.49 161.35,56.4 159,54.05 JP19.1
COL_1
  Bottom 0.61: MS_SEC_REG.3 143.94,13.54 144.6,12.88 145.82,12.88 149.15,9.55
  Bottom 1.016: COLON1.K 112.42,28.04 104.04,19.66 104.04,6.1 106.48,3.66 147.32,3.66 149.15,5.49 149.15,9.55
COL_2
  Bottom 0.61: LS_MIN_REG.3 82.17,13.74 83.03,12.88 84.33,12.88
  Bottom 1.016: COLON2.K 112.42,49.17 111,50.6 108.71,50.6 107.09,48.97 107.09,25.6 94.36,12.88 84.33,12.88
COUNTER
  Bottom 0.29: R42.2 156.35,66.04 155.04,66.04 154.09,65.09 FFC_CON.8 154.09,55.74 153.72,55.37
  Bottom 0.61: 153.72,55.37 149.66,51.31 140,51.31 139.4,51.31 139.38,51.31 EXPANDER.9
CTS
  Bottom 0.394: FTDI.11 163.69,56.55 163.03,57.2 160.22,57.2 JP10.1
D_BLOCK  (via drill 0.35)
  Top 0.61: v188.98,14.63 v136.55,14.63 v74.57,14.63 v22.55,14.63
  Bottom 0.305: 189.05,14.71 v188.98,14.63 | LS_MIN_REG.8 75.74,14.63 | MS_SEC_REG.8 137.52,14.63 | MS_MIN_REG.8 23.72,14.63
  Bottom 0.508: ATMEGA328P.14 142.82,29.46
  Bottom 0.61: LS_SEC_REG.8 189.05,14.71 | 75.74,14.63 v74.57,14.63 | 137.52,14.63 v136.55,14.63 135.33,14.63 134.52,15.44 134.52,21.74 140.59,27.82 142.18,27.82 142.82,28.46 142.82,29.46 | 23.72,14.63 v22.55,14.63 | R36.1 137.59,13.27 MS_SEC_REG.8
D_RCK  (via drill 0.35)
  Top 0.61: v24.99,19.1 26.01,18.09 v77.01,18.09 v138.79,18.09 v191.62,18.09
  Bottom 0.305: 24.99,20.78 MS_MIN_REG.10 | 77.01,20.78 LS_MIN_REG.10
  Bottom 0.508: 144.42,28.4 ATMEGA328P.12
  Bottom 0.61: LS_SEC_REG.10 191.69,18.16 v191.62,18.09 | v24.99,19.1 24.99,20.78 | 77.01,20.78 v77.01,18.09 | v138.79,18.09 138.86,18.16 MS_SEC_REG.10 138.86,21.87 137.97,22.76 137.97,23.37 141.43,26.82 142.85,26.82 144.42,28.4
D_SCK  (via drill 0.35)
  Top 0.61: v197.92,19.1 v145.29,19.1 v132.08,19.1 v106.07,19.1 v83.52,19.1 v31.5,19.1
  Bottom 0.305: 31.5,20.78 MS_MIN_REG.15 | 83.52,20.78 LS_MIN_REG.15 | 145.29,20.78 MS_SEC_REG.15
  Bottom 0.508: ATMEGA328P.17 139.78,30.66
  Bottom 0.61: LS_SEC_REG.15 198.04,19.23 v197.92,19.1 | v31.5,19.1 31.5,20.78 | v83.52,19.1 83.52,20.78 | v145.29,19.1 145.29,20.78 | v132.08,19.1 132.08,22.96 139.78,30.66
  Bottom 1.016: SPI_JUMPERS.4 112.72,38.61 111.56,37.44 111.56,34.11 115.01,30.66 115.01,28.18 113.3,26.47 112.95,26.47 106.07,19.59 v106.07,19.1
D_SI  (via drill 0.35, 0.65 pad 0.55)
  Top 0.61: v186.78,21.13 149.76,21.13 | 149.76,21.13 v141.63,29.26 | 149.76,21.13 138.58,21.13 133.71,26.01 132.69,26.01 131.67,26.01 128.68,26.01 SPI_JUMPERS.3
  Bottom 0.305: 189.85,18.02 190.62,17.25 192.84,17.25
  Bottom 0.508: ATMEGA328P.15 142.01,29.64 v141.63,29.26
  Bottom 0.61: LS_SEC_REG.2 198.04,15.76 196.56,17.25 192.84,17.25 | v186.78,21.13 186.78,21.09 189.85,18.02
DCD
  Bottom 0.394: FTDI.10 164.34,52.88 165,52.22 165,50.49 JP15.1
DSR
  Bottom 0.394: FTDI.9 164.99,53.25 165.81,52.43 165.81,49.17 164.29,47.66 161.65,47.66 161.04,48.27 JP12.1
DTR
  Bottom 0.394: FTDI.2 169.54,53.96 170.94,52.55 170.94,50.26
  Bottom 0.61: 170.94,50.26 165.79,45.11 C10.2
ENC_A
  Bottom 0.29: R33.2 159.36,66.9 157.89,65.43 155.25,65.43 154.59,64.77 FFC_CON.7 154.59,54.82 154.03,54.25
  Bottom 0.61: 154.03,54.25 150.16,50.39 137.97,50.39 136.55,51.82 136.55,53.03 137.03,53.52 EXPANDER.10
ENC_B
  Bottom 0.29: R31.2 159.18,64.82 155.45,64.82 155.09,64.46 FFC_CON.6 155.09,53.9 154.43,53.24
  Bottom 0.61: 154.43,53.24 150.57,49.38 137.57,49.38 135.53,51.41 135.53,53.44 136.88,54.79 EXPANDER.11
EXP_INT  (via drill 0.35)
  Top 1.016: v144.47,57.3 145.29,56.49 145.29,38 v145.69,37.59
  Bottom 0.508: ATMEGA328P.32 146.81,37.9 146.51,37.59 v145.69,37.59
  Bottom 0.61: EXPANDER.13 144.45,57.33 v144.47,57.3
EXP_SCL  (via drill 0.35)
  Top 1.016: v143.6,44.09 143.6,44.7 142.79,45.52 142.79,58.38 v142.65,58.52
  Bottom 0.305: 143.61,44.09 v143.6,44.09
  Bottom 0.508: ATMEGA328P.28 143.61,44.09
  Bottom 0.61: v142.65,58.52 142.57,58.6 EXPANDER.14
EXP_SDA  (via drill 0.35)
  Top 1.016: v142.65,37.8 142.01,38.43 142.01,43.71 140.61,45.11 140.61,59.13 v141.22,59.74
  Bottom 0.508: ATMEGA328P.27 142.82,37.97 v142.65,37.8
  Bottom 0.61: v141.22,59.74 141.1,59.87 EXPANDER.15
FTRESET
  Bottom 0.394: FTDI.19 164.34,63.96 JP7.1
GND  (via drill 0.35)
  Top 0.61: POWER_CON.2 166.42,40.03 164.59,41.86 164.59,44.3 169.27,48.97 170.49,48.97 172.52,51 172.52,54.46 170.28,56.69 167.03,56.69 163.07,60.66 152.71,60.66 | v165.05,59.23 163.73,57.91 155.45,57.91 152.71,60.66 | 152.71,60.66 v151.21,62.15 | J_REG_9V_1.GND 173.53,29.87 171.4,32 BATTERY_CON.3 | v103.83,32.92 111.56,32.92 121.31,23.16 v121.31,22.76
  Bottom 0.394: FTDI.18 163.69,60.59 v165.05,59.23 166.29,57.99 FTDI.7 | FTDI.21 165.64,61.44 166.37,60.71 167.64,60.71 | 167.64,60.71 168.24,61.3 168.24,61.8 | FTDI.25 | FTDI.25 168.24,61.8 | FTDI.26 168.24,61.8 | C3.- 173,60.71 v167.84,60.71 167.64,60.71
  Bottom 0.508: 149.43,36.3 ATMEGA328P.3 146.43,36.3 144.47,34.34 143.05,34.34 141.88,35.51 ATMEGA328P.21 137.96,35.51 133.64,39.83 | 149.43,36.3 149.76,35.97 149.76,34.95 149.5,34.7 ATMEGA328P.5 | 149.43,36.3 150.44,36.3 v150.57,36.17 | R48.2 199.76,53.47 CHARGER.3 204.8,53.47 CHARGER.ETP
  Bottom 0.61: C17.1 150.98,21.34 149.76,22.55 146.91,22.55 146.48,22.12 MS_SEC_REG.16 | C32.2 130.07,38.22 130.45,38.61 C4.2 131.23,39.59 131.47,39.83 133.64,39.83 | MS_MIN_REG.16 34.27,20.85 34.34,20.93 35.15,20.12 C15.1 | CHARGER.1 202.69,49.08 202.79,48.97 204.22,48.97 205.44,50.19 CHARGER.ETP | R48.2 v199.75,54.66 | LS_SEC_REG.16 201.29,20.85 201.37,20.93 201.42,20.88 | C7.2 181.23,35.37 C6.1 | LS_MIN_REG.16 84.71,23.14 85.14,23.57 86.56,23.57 90.02,20.12 90.02,15.2 C16.1 | C3.- 175.85,61.04 175.97,61.16 | 175.97,61.16 C5.2 | 175.97,61.16 177.8,62.99 185.12,62.99 185.93,63.8 185.93,68.68 | C8.1 207.66,68.08 203.61,72.14 187.55,72.14 185.93,70.51 185.93,68.68 | v151.21,62.15 150.42,62.94 C14.1 | v121.31,22.76 121.31,13.21 v120.29,12.19 | EXPANDER.1 EXPANDER.2 EXPANDER.3 146.38,58.6 145.9,58.12 145.9,52.83 146.48,52.25 EXPANDER.8 | C1.1 167.07,67.67 170.28,67.67 171.7,69.09 185.52,69.09 185.93,68.68
  Bottom 0.813: C30.1 160.53,34.54 160.53,32.31 C31.-
  Bottom 1.016: LDO_5V.1 181.23,39.47 C7.2 | C2.1 205.44,55.1 CHARGER.ETP | C14.1 148.17,61.66 EXPANDER.1
  other vias: 150.57,23.37 96.52,59.13 88.6,24.18 71.73,23.57 125.98,35.56
  pour Top (isolate 1.016): 1.22,71.93 221.08,71.93 221.08,1.22 1.22,1.22
  pour Bottom (isolate 1.016): 1.22,71.93 221.08,71.93 221.08,1.22 1.22,1.22
  cutout Bottom (no thermals): 148.54,39.62 148.54,30.48 139.4,30.48 139.4,39.62
L_COUNTER
  Bottom 0.508: 139.78,38.2 ATMEGA328P.24
  Bottom 0.61: R52.2 153.45,48.36 143.05,48.36 139.78,45.09 139.78,38.2
L_VOLUME
  Bottom 0.508: 142.01,40.44 ATMEGA328P.26
  Bottom 0.61: R64.2 157.89,48.12 156.09,46.33 143.87,46.33 142.01,44.48 142.01,40.44
L_WARNING
  Bottom 0.508: ATMEGA328P.25 140.82,39.75
  Bottom 0.61: 140.82,39.75 140.82,44.7 143.41,47.3 155.24,47.3 155.85,47.91 R47.2
LIGHT_SENS
  Bottom 0.508: ATMEGA328P.23 138.79,37.11 138.14,37.76
  Bottom 0.61: 138.14,37.76 138.14,40.4 136.83,41.71 134.52,41.71
  Bottom 1.016: 115.21,24.79 114.55,24.79 POTENTIOMETER.2 114.4,8.08 PHOTORES.2
  Bottom 2.032: 115.21,24.79 117.65,27.23 117.65,30.58 128.78,41.71 134.52,41.71
LM_A
  Bottom 0.61: 80.9,26.24 LS_MIN_REG.13
  Bottom 1.016: R7.2 82.7,28.04 80.9,26.24
LM_B
  Bottom 0.61: 82.17,24.05 LS_MIN_REG.14
  Bottom 1.016: R6.2 85.34,27.23 82.17,24.05
LM_C
  Bottom 0.61: LS_MIN_REG.4 80.9,13.42 81.69,12.64 R5.2
LM_D
  Bottom 0.61: LS_MIN_REG.5 79.63,12.46 R4.2
LM_E
  Bottom 0.61: R3.2 78.36,13.37 LS_MIN_REG.6
LM_F
  Bottom 0.61: 79.63,25.02 LS_MIN_REG.12
  Bottom 1.016: R2.2 77.83,26.82 79.63,25.02
LM_G
  Bottom 0.61: 78.36,23.65 LS_MIN_REG.11
  Bottom 1.016: R1.2 75.18,26.82 78.36,23.65
LS_A
  Bottom 0.61: LS_SEC_REG.13 195.5,22.73 194.06,24.18 194.06,25.81
  Bottom 1.016: R21.2 193.24,26.62 194.06,25.81
LS_B
  Bottom 0.61: LS_SEC_REG.14 196.77,25.4
  Bottom 1.016: 196.77,25.4 195.35,26.82 195.35,61.61 R20.2
LS_C
  Bottom 0.61: R19.2 196.9,11.82 195.5,13.22 LS_SEC_REG.4
LS_D
  Bottom 0.61: R18.2 194.23,12.26 LS_SEC_REG.5
LS_E
  Bottom 0.61: R17.2 192.96,13.17 LS_SEC_REG.6
LS_F
  Bottom 0.61: LS_SEC_REG.12 194.23,22.37 192.23,24.38 192.23,25.2
  Bottom 1.016: R16.2 190.6,26.82 192.23,25.2
LS_G
  Bottom 0.61: LS_SEC_REG.11 192.96,22.02 188.16,26.82
  Bottom 1.016: 188.16,26.82 R15.2
MISO  (via drill 0.35)
  Top 0.61: SPI_JUMPERS.6 113.59,36.02 113.59,32.97 123.27,23.29 v133.99,23.29
  Bottom 0.508: ATMEGA328P.16 141.22,30.45 140.63,29.86
  Bottom 0.61: v133.99,23.29 134.06,23.29 140.63,29.86
MM_A
  Bottom 0.61: 28.88,25.63 MS_MIN_REG.13
  Bottom 1.016: R27.2 30.07,26.82 28.88,25.63
MM_B
  Bottom 0.61: 30.15,24.26 MS_MIN_REG.14
  Bottom 1.016: R26.2 32.51,26.62 30.15,24.26
MM_C
  Bottom 0.61: MS_MIN_REG.4 28.88,13.42 29.46,12.84 R25.2
MM_D
  Bottom 0.61: MS_MIN_REG.5 27.61,13.02 27.23,12.64 R24.2
MM_E
  Bottom 0.61: MS_MIN_REG.6 26.34,13.78 R23.2
MM_F
  Bottom 0.61: 27.61,24.41 MS_MIN_REG.12
  Bottom 1.016: R22.2 24.77,27.25 27.61,24.41
MM_G
  Bottom 0.61: 26.34,23.24 MS_MIN_REG.11
  Bottom 1.016: R28.2 22.35,27.23 26.34,23.24
MS_A  (via drill 0.35, 0.65 pad 0.55)
  Top 1.016: v142.65,64.41 137.79,64.41 131.5,58.12 131.5,34.51 142.03,23.98 v142.65,23.98
  Bottom 0.61: R14.2 144.24,64.41 v142.65,64.41 | MS_SEC_REG.13 142.67,23.95 v142.65,23.98
MS_B  (via drill 0.35, 0.65 pad 0.55)
  Top 1.016: v143.26,25.6 142.44,25.6 133.3,34.75 133.3,57.3 138.99,62.99 148.34,62.99 v149.56,64.21
  Bottom 0.61: MS_SEC_REG.14 143.94,24.92 v143.26,25.6
  Bottom 1.016: v149.56,64.21 148.98,64.78 R13.2
MS_C
  Bottom 0.61: MS_SEC_REG.4 142.67,13.42 143.46,12.64 R12.2
MS_D
  Bottom 0.61: MS_SEC_REG.5 141.4,12.46 R11.2
MS_E
  Bottom 0.61: MS_SEC_REG.6 140.13,13.17 R10.2
MS_F  (via drill 0.35, 0.65 pad 0.55)
  Top 0.813: v141.43,22.76 v141.42,22.76 139.9,24.28 139.7,24.28
  Top 1.016: v132.28,61.16 129.64,58.52 129.64,34.34 139.7,24.28
  Bottom 0.61: MS_SEC_REG.12 141.43,20.88 v141.43,22.76
  Bottom 1.016: R9.2 139.4,64.21 138.18,62.99 134.11,62.99 v132.28,61.16
MS_G  (via drill 0.35, 0.65 pad 0.55)
  Top 1.016: v134.93,64.41 133.3,64.41 127.84,58.96 127.84,33.9 138.78,22.96 v139.4,22.96
  Bottom 0.61: MS_SEC_REG.11 140.13,22.23 v139.4,22.96
  Bottom 1.016: R8.2 134.96,64.38 v134.93,64.41
N$1
  Bottom 1.016: R32.2 R50.1
N$3
  Bottom 1.016: R22.1 24.77,68.39 MSDIGIT_MINUTES.F
N$13
  Bottom 1.016: R1.1 LSDIGIT_MINUTES.G
N$14
  Bottom 1.016: MSDIGIT_MINUTES.E 24.79,8.41 R23.1
N$15
  Bottom 1.016: LSDIGIT_MINUTES.F 77.83,68.4 R2.1
N$16
  Bottom 1.016: R3.1 77.42,8.61 LSDIGIT_MINUTES.E
N$17
  Bottom 1.016: R4.1 79.65,8.91 LSDIGIT_MINUTES.D
N$18
  Bottom 1.016: LSDIGIT_MINUTES.C 82.8,9.52 81.8,10.53 R5.1
N$19
  Bottom 1.016: R6.1 LSDIGIT_MINUTES.B
N$20
  Bottom 0.29: FFC_CON.3 156.59,52.74 156.89,52.44
  Bottom 0.61: R64.1 157.89,51.45 156.89,52.44
N$21
  Bottom 1.016: R24.1 27.23,8.51 MSDIGIT_MINUTES.D
N$22
  Bottom 0.29: FFC_CON.4 156.09,51.61
  Bottom 0.61: R47.1 156.09,50.67 156.09,51.21 | 156.09,51.21 156.09,51.61 | 156.09,51.21
N$23
  Bottom 1.016: R25.1 29.87,10.12 29.87,8.41 MSDIGIT_MINUTES.C
N$24  (via drill 0.35)
  Top 0.61: v187.96,15.65 v135.94,15.65 v73.76,15.65 25.81,15.65 v24.99,16.46
  Bottom 0.61: LS_SEC_REG.7 191.69,16.18 191.41,16.46 188.77,16.46 v187.96,15.65 | LS_MIN_REG.7 77.09,15.77 76.4,16.46 74.37,16.46 73.76,15.85 v73.76,15.65 | MS_SEC_REG.7 138.86,15.77 138.18,16.46 136.75,16.46 v135.94,15.65 | R29.1 24.83,16.62 v24.99,16.46 25.07,16.38 MS_MIN_REG.7
N$25
  Bottom 1.016: LSDIGIT_MINUTES.A 82.7,68.4 R7.1
N$27
  Bottom 0.394: FTDI.17 163.04,64.21 163.04,64.53 163.13,64.62
  Bottom 0.61: C1.2 164.35,65.84 163.13,64.62
N$29
  Bottom 0.305: 109.93,48.31 COLON2.A
  Bottom 1.016: R34.2 109.93,48.31
N$30
  Bottom 0.29: FFC_CON.5 155.59,52.6 155.23,52.24
  Bottom 0.61: R52.1 153.82,50.84 155.23,52.24
N$31
  Bottom 1.016: R26.1 MSDIGIT_MINUTES.B
N$32
  Bottom 1.016: R27.1 30.07,68.4 MSDIGIT_MINUTES.A
N$33
  Bottom 1.016: R8.1 MSDIGIT_SECONDS.G
N$34
  Bottom 1.016: R9.1 139.4,68.4 MSDIGIT_SECONDS.F
N$35
  Bottom 1.016: R10.1 139.4,8.41 MSDIGIT_SECONDS.E
N$36  (via drill 0.35)
  Top 0.813: v184.1,65.02 201.98,47.14 v211.94,47.14
  Bottom 0.394: FTDI.23 166.94,63.47 167.35,63.89
  Bottom 0.813: v184.1,65.02 168.49,65.02 167.35,63.89 | v211.94,47.14 R66.2
N$37
  Bottom 1.016: R11.1 141.43,8.91 MSDIGIT_SECONDS.D
N$38
  Bottom 1.016: MSDIGIT_SECONDS.C 144.58,9.32 143.57,10.33 R12.1
N$39
  Bottom 1.016: R13.1 MSDIGIT_SECONDS.B
N$40
  Bottom 1.016: MSDIGIT_SECONDS.A 144.27,68.07 R14.1
N$41
  Bottom 1.016: LSDIGIT_SECONDS.G 188.16,66.85 R15.1
N$42
  Bottom 1.016: LSDIGIT_SECONDS.F 192.33,67.5 190.6,65.85 R16.1
N$43  (via drill 0.35)
  Top 0.813: v211.94,49.17 201.69,49.17 184.42,66.45 v184.3,66.45
  Bottom 0.394: 166.75,65.1 166.29,64.63 FTDI.22
  Bottom 0.813: 166.75,65.1 168.11,66.45 v184.3,66.45 | R65.2 v211.94,49.17
N$44
  Bottom 1.016: R17.1 192.23,8.41 LSDIGIT_SECONDS.E
N$45
  Bottom 1.016: R18.1 194.87,9.92 LSDIGIT_SECONDS.D
N$46
  Bottom 1.016: R19.1 197.31,8.41 LSDIGIT_SECONDS.C
N$47
  Bottom 1.016: R20.1 196.7,64.82 199.95,68.07 LSDIGIT_SECONDS.B
N$48
  Bottom 1.016: LSDIGIT_SECONDS.A 197.51,68.11 194.06,64.66 R21.1
N$49
  Bottom 1.016: R34.1 R35.2
N$52
  Bottom 0.61: CHARGER.7 210.95,52.2
  Bottom 0.813: 210.95,52.2 211.94,51.21 R39.2
N$53
  Bottom 0.305: 212.89,53.47 R40.2
  Bottom 0.61: CHARGER.6 212.89,53.47
N$54
  Bottom 0.813: CHRG_LED.C R39.1
N$55
  Bottom 0.813: R40.1 STDBY_LED.C
N$56
  Bottom 0.305: 109.93,28.5 COLON1.A
  Bottom 1.016: R50.2 109.93,28.5
N$57
  Bottom 1.016: R28.1 MSDIGIT_MINUTES.G
N$64
  Bottom 0.813: TXLED.C R66.1
N$65
  Bottom 0.991: R30.1 66.47,30.01 NPN_AMP.1
N$66
  Bottom 0.991: 54,29.06 NPN_AMP.3
  Bottom 1.016: BUZZER.2 54,29.06
N$74
  Bottom 0.813: R65.1 RXLED.C
N$78  (via drill 0.35)
  Top 0.305: v86.77,20.14 86.79,20.12
  Top 0.61: 86.79,20.12 135.74,20.12 v136.35,20.73
  Bottom 0.305: 136.47,20.85 v136.35,20.73
  Bottom 0.61: MS_SEC_REG.9 136.47,20.85 | v86.77,20.14 83.44,16.81 LS_MIN_REG.2
N$79
  Bottom 0.305: MS_MIN_REG.2 31.42,13.69
  Bottom 0.61: 34.34,13.01 32.11,13.01 31.42,13.69 | LS_MIN_REG.9 75.44,20.47
  Bottom 1.27: 75.44,20.47 67.97,13.01 34.34,13.01
N$80  (via drill 0.35)
  Top 0.61: v189.38,20.73 188.77,20.12 v149.15,20.12
  Bottom 0.305: LS_SEC_REG.9 189.51,20.85 v189.38,20.73
  Bottom 0.61: v149.15,20.12 148.13,20.12 145.21,17.2 MS_SEC_REG.2
N$81
  Top 2.032: SWITCH.5 207.26,57.15 209.14,55.27 | J_REG_9V_1.VIN 177.39,27.33
  Top 2.54: 177.39,27.33 207.16,27.33 218.24,38.41 218.24,51.87 214.83,55.27 209.14,55.27
  Bottom 0.813: SWITCH.5 SWITCH.2
N$82
  Bottom 0.61: R48.1 200.16,52.2 CHARGER.2
OSCO
  Bottom 0.394: JP8.1 172.18,62.45 FTDI.28
PLAY/PAUSE
  Bottom 0.29: 151.84,59.08 152.09,59.34 FFC_CON.12 149.2,66.49 R46.2
  Bottom 0.61: 151.84,59.08 151.13,58.37 150.08,57.33 EXPANDER.4
RESET  (via drill 0.35)
  Top 0.61: v138.58,42.27 138.99,41.86 138.99,38.41 142.04,35.36 v143.87,35.36
  Bottom 0.305: 144.44,39.36 ATMEGA328P.29
  Bottom 0.508: 144.44,39.36 144.44,42.67 R56.1 | ATMEGA328P.29 144.42,35.92 v143.87,35.36
  Bottom 0.61: C10.1 R56.1
  Bottom 1.016: v138.58,42.27 138.58,42.67 137.36,43.89 115.67,43.89 113.54,41.76 SPI_JUMPERS.2
RI
  Bottom 0.394: FTDI.6 166.94,51.7 JP16.1
RTS
  Bottom 0.394: FTDI.3 168.89,53.41 169.57,52.73 JP9.1
RXD
  Bottom 0.394: FTDI.1 170.19,54.51 172.52,52.18
  Bottom 0.508: 145.69,41.86 145.21,41.38 ATMEGA328P.30
  Bottom 0.61: 172.52,52.18 172.52,50.23 165.36,43.08 150.98,43.08 149.76,41.86 145.69,41.86
S_VCC  (via drill 0.35)
  Top 0.61: v138.38,31.5 143.26,31.5 v145.21,33.45
  Top 1.27: v123.29,28.7 116.08,35.92 SPI_JUMPERS.5
  Bottom 0.305: 160.24,25.69 C31.+
  Bottom 0.508: ATMEGA328P.4 147.27,35.51 146.91,35.15 | ATMEGA328P.6 147.34,33.91 147.01,34.23 147.01,34.24 146.91,34.34 146.91,35.15 | 146.91,35.15 v145.21,33.45 ATMEGA328P.11 145.21,29.3 145.78,28.73
  Bottom 0.61: v138.38,31.5 138.38,30.89 134.93,27.43 134.52,27.43 | 160.24,25.69 SHOTTKY.C 148.82,25.69 145.78,28.73
  Bottom 1.27: v123.29,28.7 125.88,28.7 L1.1 130.71,27.43 134.52,27.43
STOP/RESET
  Bottom 0.29: R45.2 151.23,66 152.59,64.65 FFC_CON.11 152.59,58.51 152.2,58.12
  Bottom 0.61: 152.2,58.12 151.28,57.2 150.14,56.06 EXPANDER.5
TXD  (via drill 0.35)
  Top 0.61: v146.66,40.84 146.66,44.04 148.95,46.33 v158.29,46.33
  Bottom 0.394: FTDI.5 167.59,53.7 168.25,53.03 168.25,50.6
  Bottom 0.508: v146.66,40.84 146.45,40.84 146.03,40.41 ATMEGA328P.31
  Bottom 0.61: 168.25,50.6 168.25,49.78 164.79,46.33 v158.29,46.33
UA1
  Bottom 0.508: ATMEGA328P.1 148.26,39.34 149.15,40.23 JP1.1
UA2
  Bottom 0.508: ATMEGA328P.2 149.88,37.11 152.09,39.32 JP2.1
UA3
  Bottom 0.508: ATMEGA328P.9 150.85,30.86 151.84,31.85 152.81,32.82 JP3.1
UA4
  Bottom 0.508: ATMEGA328P.19 136.37,33.91 JP4.1
UA5
  Bottom 0.508: ATMEGA328P.22 138.25,36.3 136.35,38.2 JP5.1
UD1
  Bottom 0.61: LS_SEC_REG.3 196.77,13.54 197.31,13.01 199.09,13.01 JP13.1
UD2
  Bottom 0.61: JP14.1 30.15,13.69 MS_MIN_REG.3
UP1
  Bottom 0.61: R61.2 JP6.1 135.15,56.06 EXPANDER.12
USBDM
  Bottom 0.29: FFC_CON.2 157.09,58.91 158.02,57.98
  Bottom 0.394: FTDI.16 162.39,58.82 161.54,57.98 158.02,57.98
USBDP
  Bottom 0.29: FFC_CON.1 157.59,59.43 158.29,58.73
  Bottom 0.394: FTDI.15 161.74,59.12 161.34,58.73 158.29,58.73
VCC  (via drill 0.35)
  Top 0.61: 140.41,39.22 140.41,38.44 142.17,36.69 142.18,36.69 142.39,36.47 147.01,36.47 146.71,36.17 v146.71,32.92
  Top 1.016: 160.43,43.08 v148.13,43.08 148.03,42.98 148.03,36.47 147.01,36.47 | 160.43,43.08 161.85,43.08 161.85,45.41 145.9,61.37 | 160.43,43.08 166.01,37.49 POWER_CON.3 170.59,37.49 175.26,42.17 v178.21,42.17 | v150.57,29.39 157.41,22.55 201.78,22.55 203.81,20.52 203.81,19.3 201.37,16.87 v198.93,16.87 v146.51,16.87 v133.3,16.87 v85.55,16.87 v32.72,16.87 | 140.41,39.22 140.41,42.67 138.38,44.7 v138.38,45.31 138.38,59.13 140.61,61.37 v144.88,61.37 145.9,61.37 | v160.93,64.82 152.2,64.82 148.74,61.37 145.9,61.37
  Bottom 0.305: LS_SEC_REG.1 199.31,15.24 | v32.72,16.87 32.69,16.84
  Bottom 0.508: v146.71,32.92 146.03,32.23 ATMEGA328P.10 146.03,29.94 146.57,29.39 147.53,29.39
  Bottom 0.61: v198.93,16.87 199.31,16.48 199.31,15.24 199.43,15.24 | 32.69,16.84 MS_MIN_REG.1 | C17.2 150.98,16.87 | v146.51,16.87 146.48,16.84 MS_SEC_REG.1 | C16.2 87.34,16.87 v85.55,16.87 84.71,16.03 LS_MIN_REG.1 | v32.72,16.87 32.75,16.83 | R36.2 135.53,10.73 | 152.62,29.39 SHOTTKY.A | R61.1 136.28,61.14 EXPANDER.16 144.65,61.14 v144.88,61.37 146.46,62.94 C14.2
  Bottom 0.813: R46.1 R45.1 R44.1 R43.1 R42.1 R33.1 R31.1 | C18.2 199.43,15.24
  Bottom 1.016: 147.53,29.39 v150.57,29.39 152.62,29.39 | R32.1 R35.1 110.5,40.81 115.42,45.72 137.97,45.72 v138.38,45.31 | 150.98,16.87 v146.51,16.87 | 32.75,16.83 C15.2 49.09,16.83 BUZZER.1 | R29.2 23.53,18.32 23.98,17.88 31.7,17.88 v32.72,16.87 | 135.53,10.73 133.3,12.97 v133.3,16.87 | R56.2 v148.13,43.08 | R46.1 149.24,68.68 162.76,68.68 162.97,68.48 162.97,65.96 161.82,64.82 v160.93,64.82
  Bottom 1.27: LDO_5V.4 177.24,46.18 173.53,42.47 173.53,39.58 171.45,37.49 POWER_CON.3 | C7.1 178.41,37.51 LDO_5V.2 178.41,41.96 v178.21,42.17
VDD  (via drill 0.35)
  Top 1.27: LSDIGIT_SECONDS.COM1 189.79,6.55 186.89,3.66 139.04,3.66 | 22.35,5.69 24.38,3.66 77.27,3.66 | 22.35,5.69 MSDIGIT_MINUTES.COM1 | 139.04,3.66 77.27,3.66 | 177.6,66.24 140.79,66.24 | 28.27,66.24 27.43,67.08 MSDIGIT_MINUTES.COM8 | 22.35,5.69 20.73,7.32 20.73,64.62 22.35,66.24 28.27,66.24 | 139.04,3.66 136.96,5.74 MSDIGIT_SECONDS.COM1 | 77.27,3.66 75.18,5.74 LSDIGIT_MINUTES.COM1 | v183.69,43.08 183.69,48.36 177.6,54.46 177.6,66.24 | 177.6,66.24 177.6,67.46 178.41,68.28 185.12,68.28 187.55,65.84 193.85,65.84 194.87,66.85 LSDIGIT_SECONDS.COM8 | 140.79,66.24 79.45,66.24 | 79.45,66.24 28.27,66.24 | LSDIGIT_MINUTES.COM8 80.26,67.06 79.45,66.24 | MSDIGIT_SECONDS.COM8 142.04,67.49 140.79,66.24
  Bottom 0.61: C6.2 183.08,35.36 183.69,35.36
  Bottom 1.27: J_REG_9V_1.VOUT 176.1,32.79 LDO_5V.3 176.1,42.39 177.6,43.89 182.88,43.89 v183.69,43.08 183.69,35.36 | 183.08,35.36 183.08,15.04 LSDIGIT_SECONDS.COM1
VOLUME
  Bottom 0.29: R44.2 152.88,67.02 152.88,65.23 153.09,65.02 FFC_CON.10 153.09,57.58 152.71,57.2
  Bottom 0.61: 152.71,57.2 151.08,55.58 150.29,54.79 EXPANDER.6
WARNING
  Bottom 0.29: R43.2 155.09,67.02 153.59,65.52 FFC_CON.9 153.59,56.66 153.01,56.08
  Bottom 0.61: 153.01,56.08 151.18,54.25 150.44,53.52 EXPANDER.7
XTAL1
  Bottom 0.394: ATMEGA328P.7 149.48,33.1 149.5,33.12
  Bottom 0.61: C29.2 156.02,39.1 QUARTZ.X2 155.45,39.06 149.5,33.12
XTAL2
  Bottom 0.305: 156.02,36.49 QUARTZ.X1
  Bottom 0.508: 150.42,32.31 ATMEGA328P.8
  Bottom 0.61: C30.2 156.02,36.49 | QUARTZ.X1 154.63,36.52 150.42,32.31